# EasyEDA Pro project Lamp Daughter Board V0.1.epro

# Schematic Schematic2
Board Name: Board3; Create Date: 2025-07-31; Page Name: P1; Project Name: GCSE LAMP PCBs; Schematic Name: Schematic2; Update Date: 2025-07-31; Company: EasyEDA.com; Page Size: A4; Version: V1.0
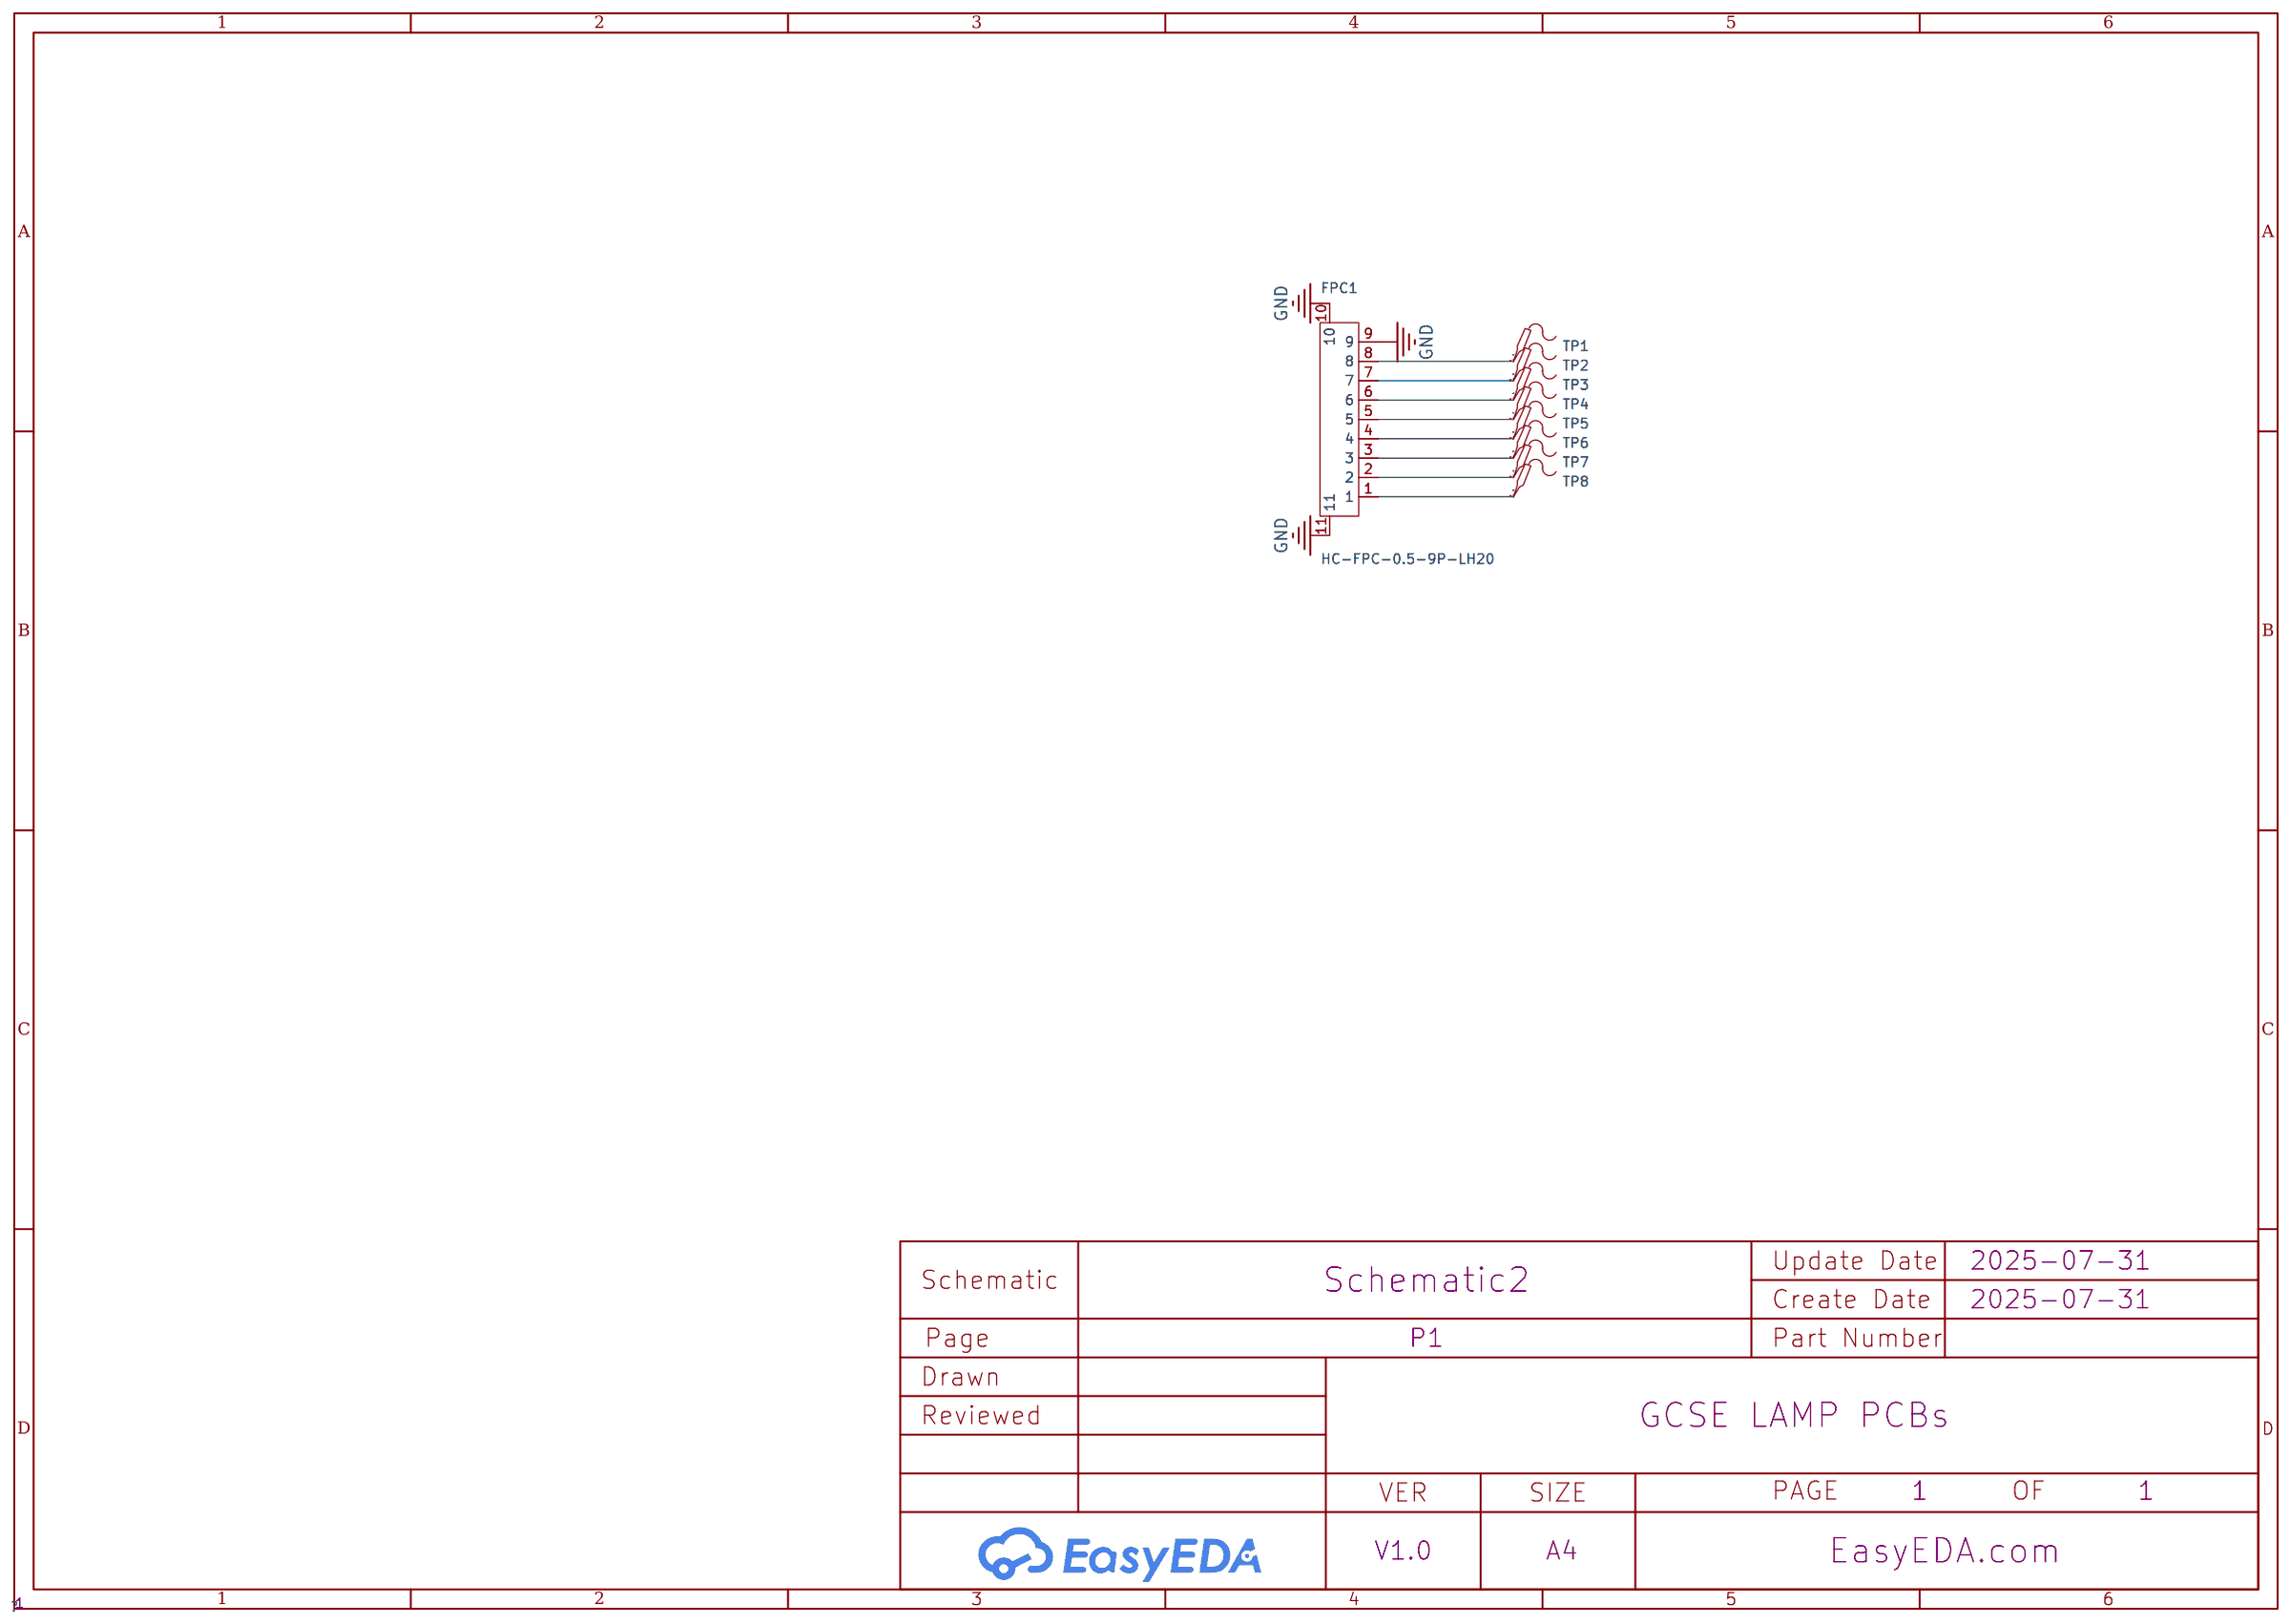
[diagram p0: schematic sheet]

## Parts
FPC1  HC-FPC-0.5-9P-LH20  [FPC-SMD_9P-P0.50_HC-FPC-0.5-9P-LH20]
TP1  -  [Test-Point-0.5mm]
TP2  -  [Test-Point-0.5mm]
TP3  -  [Test-Point-0.5mm]
TP4  -  [Test-Point-0.5mm]
TP5  -  [Test-Point-0.5mm]
TP6  -  [Test-Point-0.5mm]
TP7  -  [Test-Point-0.5mm]
TP8  -  [Test-Point-0.5mm]

## Library data of the parts
FPC1 = HC-FPC-0.5-9P-LH20: Locking Feature:Slide Lock Contact Type:Single-side Contact/Vertical Number of Contacts:9P Pitch:0.5mm Mounting Type:Surface Mount,Vertical FFC, FCB Thickness:0.3mm FFC, FCB Thickness:0.3mm Height Above Board:4.5mm Contact Material:- Contact Plating:- Ope; LCSC Part Name: 抽屉式 单侧触点/垂直 P数:9P 间距:0.5mm; Supplier Part: C49166890; Manufacturer: HC(虹成电子); Supplier Footprint: SMD,P=0.5mm(交错脚); JLCPCB Part Class: Extended Part; Datasheet: https://atta.szlcsc.com/upload/public/pdf/source/20250613/82F48CADE1F9CB45E74CB3AE3886D5BC.pdf; Supplier: LCSC; Locking Feature: Slide Lock; Contact Type: Single-side Contact/Vertical; Number of Contacts: 9P; Pitch: 0.5mm; Mounting Type: Surface Mount,Vertical; FFC, FCB Thickness: 0.3mm; Height Above Board: 4.5mm; Operating Temperature: -25℃~+85℃
TP1-TP8 = Test-Point: Test Point 测试点

## Nets
GND: FPC1.9 FPC1.10 FPC1.11
$1N349: FPC1.7 TP2.1
$1N353: FPC1.8 TP1.1
$1N358: FPC1.6 TP3.1
$1N363: FPC1.5 TP4.1
$1N368: FPC1.3 TP6.1
$1N387: FPC1.1 TP8.1
$1N390: FPC1.2 TP7.1
$1N551: FPC1.4 TP5.1

# Board DIY But maybe
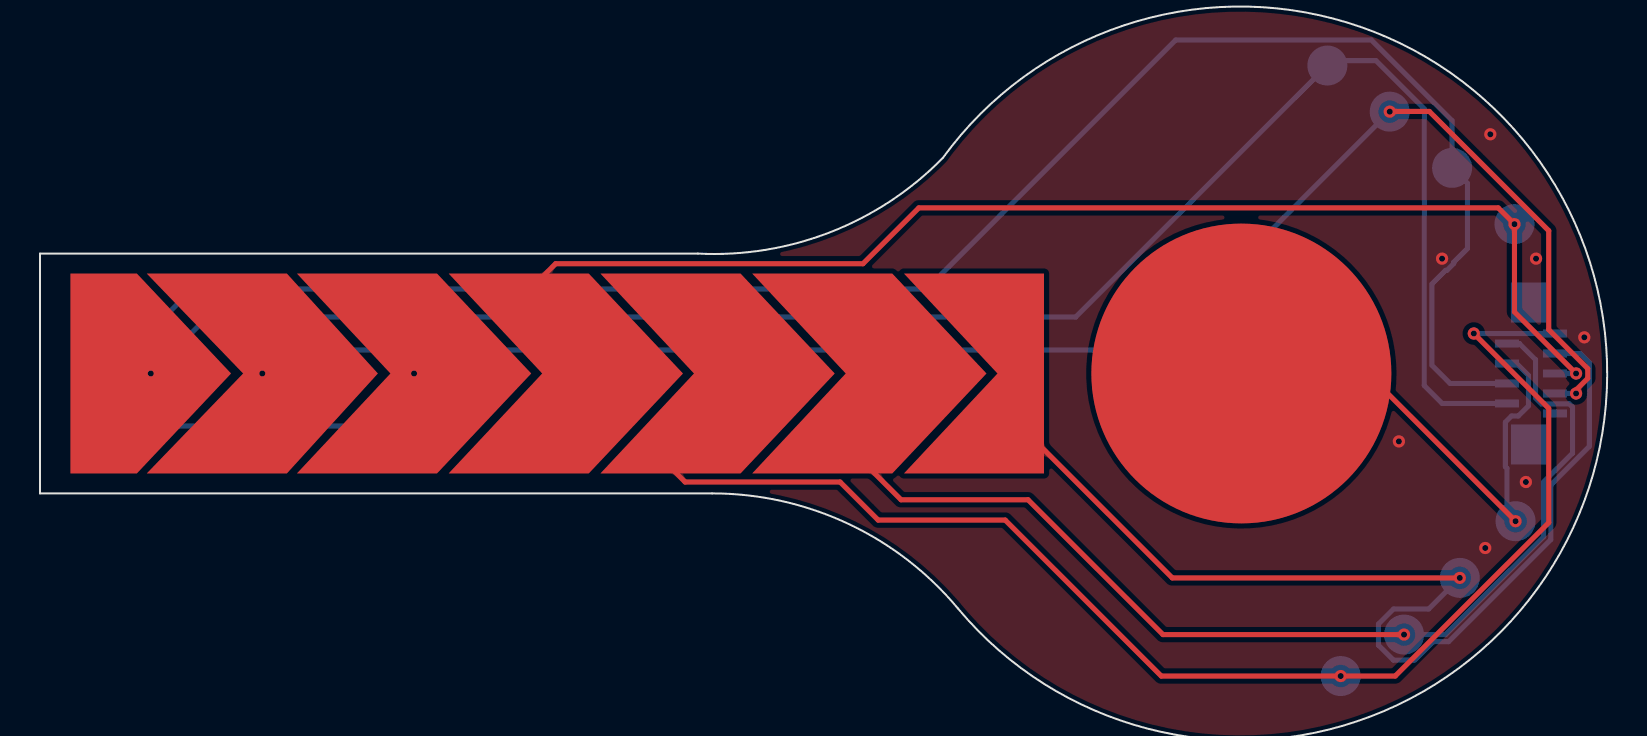
[diagram p1: board, top side]
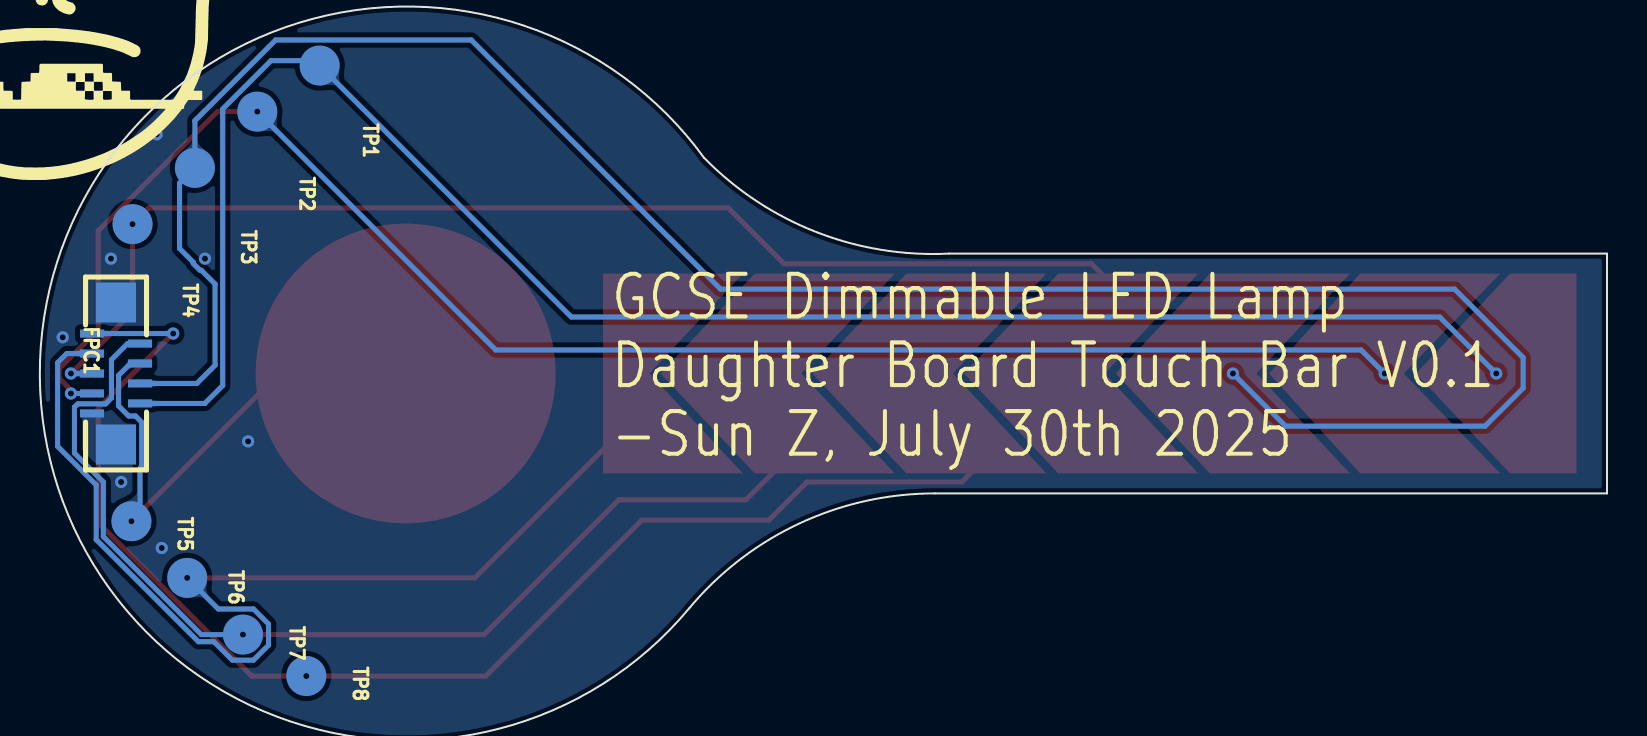
[diagram p2: board, bottom side, seen from below]

Outline 78.36 x 36.72 mm; copper layers: Top Layer, Bottom Layer. Coordinates in mm from the lower left corner of the outline.
Outline path: 0,24.37 0,12.37 33.61,12.37 arc(40.39,10.86) 45.9,6.61 arc(78.35,18.98) 45.14,29.15 arc(39.53,25.44) 32.89,24.37 0,24.37
Stack: Top Layer 0.035mm / Dielectric1 1.51mm FR4 er 4.5 / Bottom Layer 0.035mm

## Design rules (mm)
template: Custom Config
spacing copperThickness1oz (default): track to track 0.102, other pairs 0.152 to 0.3
spacing copperThickness2oz: track to track 0.203, other pairs 0.152 to 0.3
track width copperThickness1oz (default): min 0.127, default 0.254, max 2.54
track width copperThickness2oz: min 0.203, default 0.254, max 2.54
differential pair differentialPair (default): width min 0.127, default 0.254, max 2.54; gap min 0.152, default 0.152
via viaSize (default): diameter min 0.5, default 0.61, max 10; hole min 0.3, default 0.305, max 6.3
pour e480 uses copperRegion

## Placement (name value [footprint] x y rotation side)
FPC1  HC-FPC-0.5-9P-LH20  [FPC-SMD_9P-P0.50_HC-FPC-0.5-9P-LH20]  74.55 18.37 270 bottom
NOREF  -  [Pad_e707]  5.54 18.37 0 top
NOREF#2  -  [Pad_e710]  26.29 18.37 0 top
NOREF#3  -  [Pad_e711]  33.88 18.37 0 top
NOREF#4  -  [Pad_e709]  18.7 18.37 0 top
NOREF#5  -  [Pad_e714]  60.07 18.37 180 top
NOREF#6  -  [Pad_e708]  11.12 18.37 0 top
NOREF#7  -  [Pad_e713]  49.04 18.37 0 top
NOREF#8  -  [Pad_e712]  41.47 18.37 0 top
TP1  -  [Test-Point-0.5mm]  64.37 33.77 180 bottom
TP2  -  [Test-Point-0.5mm]  67.49 31.47 180 bottom
TP3  -  [Test-Point-0.5mm]  70.61 28.65 180 bottom
TP4  -  [Test-Point-0.5mm]  73.72 25.84 180 bottom
TP5  -  [Test-Point-0.5mm]  73.78 10.97 90 bottom
TP6  -  [Test-Point-0.5mm]  70.99 8.14 90 bottom
TP7  -  [Test-Point-0.5mm]  68.2 5.3 90 bottom
TP8  -  [Test-Point-0.5mm]  65.03 3.23 90 bottom

## Footprints (pads in the part's own frame, mm; a bottom-side part is the same pattern mirrored in y, then rotated)
FPC-SMD_9P-P0.50_HC-FPC-0.5-9P-LH20
  rect 0.4x1.2 smd: 1(-2,-1.2) 2(-1.5,1.2) 3(-1,-1.2) 4(-0.5,1.2) 5(0,-1.2) 6(0.5,1.2) 7(1,-1.2) 8(1.5,1.2) 9(2,-1.2)
  rect 2x2 smd: 10(3.55,0) 11(-3.55,0)
Pad_e707
  custom 8.027x10 smd: 1(0,0)
Pad_e708
  custom 11.55x10 smd: 2(0,0)
Pad_e709
  custom 11.71x10 smd: 12(0,0)
Pad_e710
  custom 11.71x10 smd: 13(0,0)
Pad_e711
  custom 11.71x10 smd: 14(0,0)
Pad_e712
  custom 11.71x10 smd: 15(0,0)
Pad_e713
  custom 7x10 smd: 16(0,0)
Pad_e714
  round 15 smd: 1(0,0)
Test-Point-0.5mm
  round 2 smd: 1(0,0)

## Nets
GND: FPC1.9 FPC1.10 FPC1.11
$1N349: FPC1.7 NOREF#6.2 TP2.1
$1N353: FPC1.8 NOREF.1 TP1.1
$1N358: FPC1.6 NOREF#4.12 TP3.1
$1N363: FPC1.5 NOREF#2.13 TP4.1
$1N368: FPC1.3 NOREF#7.16 TP6.1
$1N387: FPC1.1 NOREF#3.14 TP8.1
$1N390: FPC1.2 NOREF#8.15 TP7.1
$1N551: FPC1.4 NOREF#5.1 TP5.1

## Via types
v1: diameter 0.61, hole 0.305, Top Layer to Bottom Layer, 19 vias

## Routing (per net, layer and track width the routed paths; a pad name or vN(x,y) marks a point on that pad's centre or on a via; arc(x,y) is an arc through that point)
GND:
  vias: v1(67.94,14.97) v1(70.1,24.11) v1(72.26,9.63) v1(72.52,30.33) v1(74.3,12.94) v1(74.8,24.11) v1(77.22,20.17)
$1N349: length 82.4
  Top Layer w0.254: v1(76.81,17.37) 76.81,17.54 77.39,18.12 77.39,18.61 75.44,20.56 75.44,25.51 69.47,31.48 67.69,31.48 67.56,31.35
  Bottom Layer w0.254: v1(76.81,17.37) FPC1.7 ; v1(11.12,18.37) 12.29,19.54 55.56,19.54 v1(67.49,31.47)
$1N353: length 89.5
  Bottom Layer w0.254: FPC1.8 70.11,16.87 69.22,17.76 69.22,31.6 66.8,34.02 64.61,34.02 TP1.1 51.79,21.19 8.36,21.19 v1(5.54,18.37)
$1N358: length 110
  Bottom Layer w0.254: v1(18.7,18.37) 16.07,15.73 6.1,15.73 4.19,17.63 4.19,19.16 7.62,22.59 44.32,22.59 56.79,35.05 66.57,35.05 70.61,31.01 TP3.1 71.37,27.89 71.37,24.62 70.69,23.93 70.69,23.87 70.35,23.53 70.28,23.53 69.6,22.84 69.6,18.78 70.51,17.87 FPC1.6
$1N363: length 61.6
  Top Layer w0.254: 24.13,22.21 25.78,23.86 41.15,23.86 43.94,26.65 72.91,26.65 v1(73.72,25.84) 73.72,21.45 v1(76.81,18.37)
  Bottom Layer w0.254: v1(76.81,18.37) FPC1.5
$1N368: length 54.9
  Top Layer w0.254: 48.51,16.24 56.61,8.14 v1(70.99,8.14)
  Bottom Layer w0.254: v1(70.99,8.14) 69.43,6.58 67.67,6.58 66.92,5.83 66.92,4.77 67.67,4.02 68.73,4.02 69.66,4.95 70.43,4.95 75.54,10.06 75.54,12.79 77.47,14.72 77.47,18.9 77.01,19.37 FPC1.3
$1N387: length 67.2
  Top Layer w0.254: 30.99,14.21 32.26,12.94 40,12.94 41.91,11.03 48.26,11.03 56.06,3.23 v1(65.03,3.23) 67.76,3.23 75.44,10.9 75.44,16.62 v1(71.69,20.37)
  Bottom Layer w0.254: FPC1.1 v1(71.69,20.37)
$1N390: length 54.2
  Top Layer w0.254: v1(68.2,5.3) 56.15,5.3 49.4,12.05 43.05,12.05 39.9,15.2
  Bottom Layer w0.254: FPC1.2 73.97,19.87 74.78,19.06 74.78,17.14 75.08,16.84 76.46,16.84 76.63,16.68 76.63,14.38 75.18,12.94 75.18,10.2 70.28,5.3 v1(68.2,5.3)
$1N551: length 26.2
  Top Layer w0.254: v1(73.78,10.97) 66.48,18.27 60.07,18.27
  Bottom Layer w0.254: v1(73.78,10.97) 73.35,11.4 73.35,13.62 73.27,13.7 73.27,15.93 73.58,16.24 73.92,16.24 74.42,16.74 74.42,18.27 73.83,18.87 FPC1.4

## Copper pours and planes (outline as drawn; the poured copper is in the pictures)
GND on Top Layer: -4.06,44.3 82.55,44.3 82.55,-8.65 -4.06,-8.65
GND on Bottom Layer: -5.84,51.54 84.58,51.54 84.58,-9.42 -5.84,-9.42

Small or netless copper shapes (teardrops, artwork), in the pictures only: 14 on Top Layer, 20 on Bottom Layer

## Text on the board
Bottom Silkscreen Layer: GCSE Dimmable LED Lamp / Daughter Board Touch Bar V0.1 / -Sun Z, July 30th 2025
